# Altium project project1_ExtensionBoard.PrjPcb
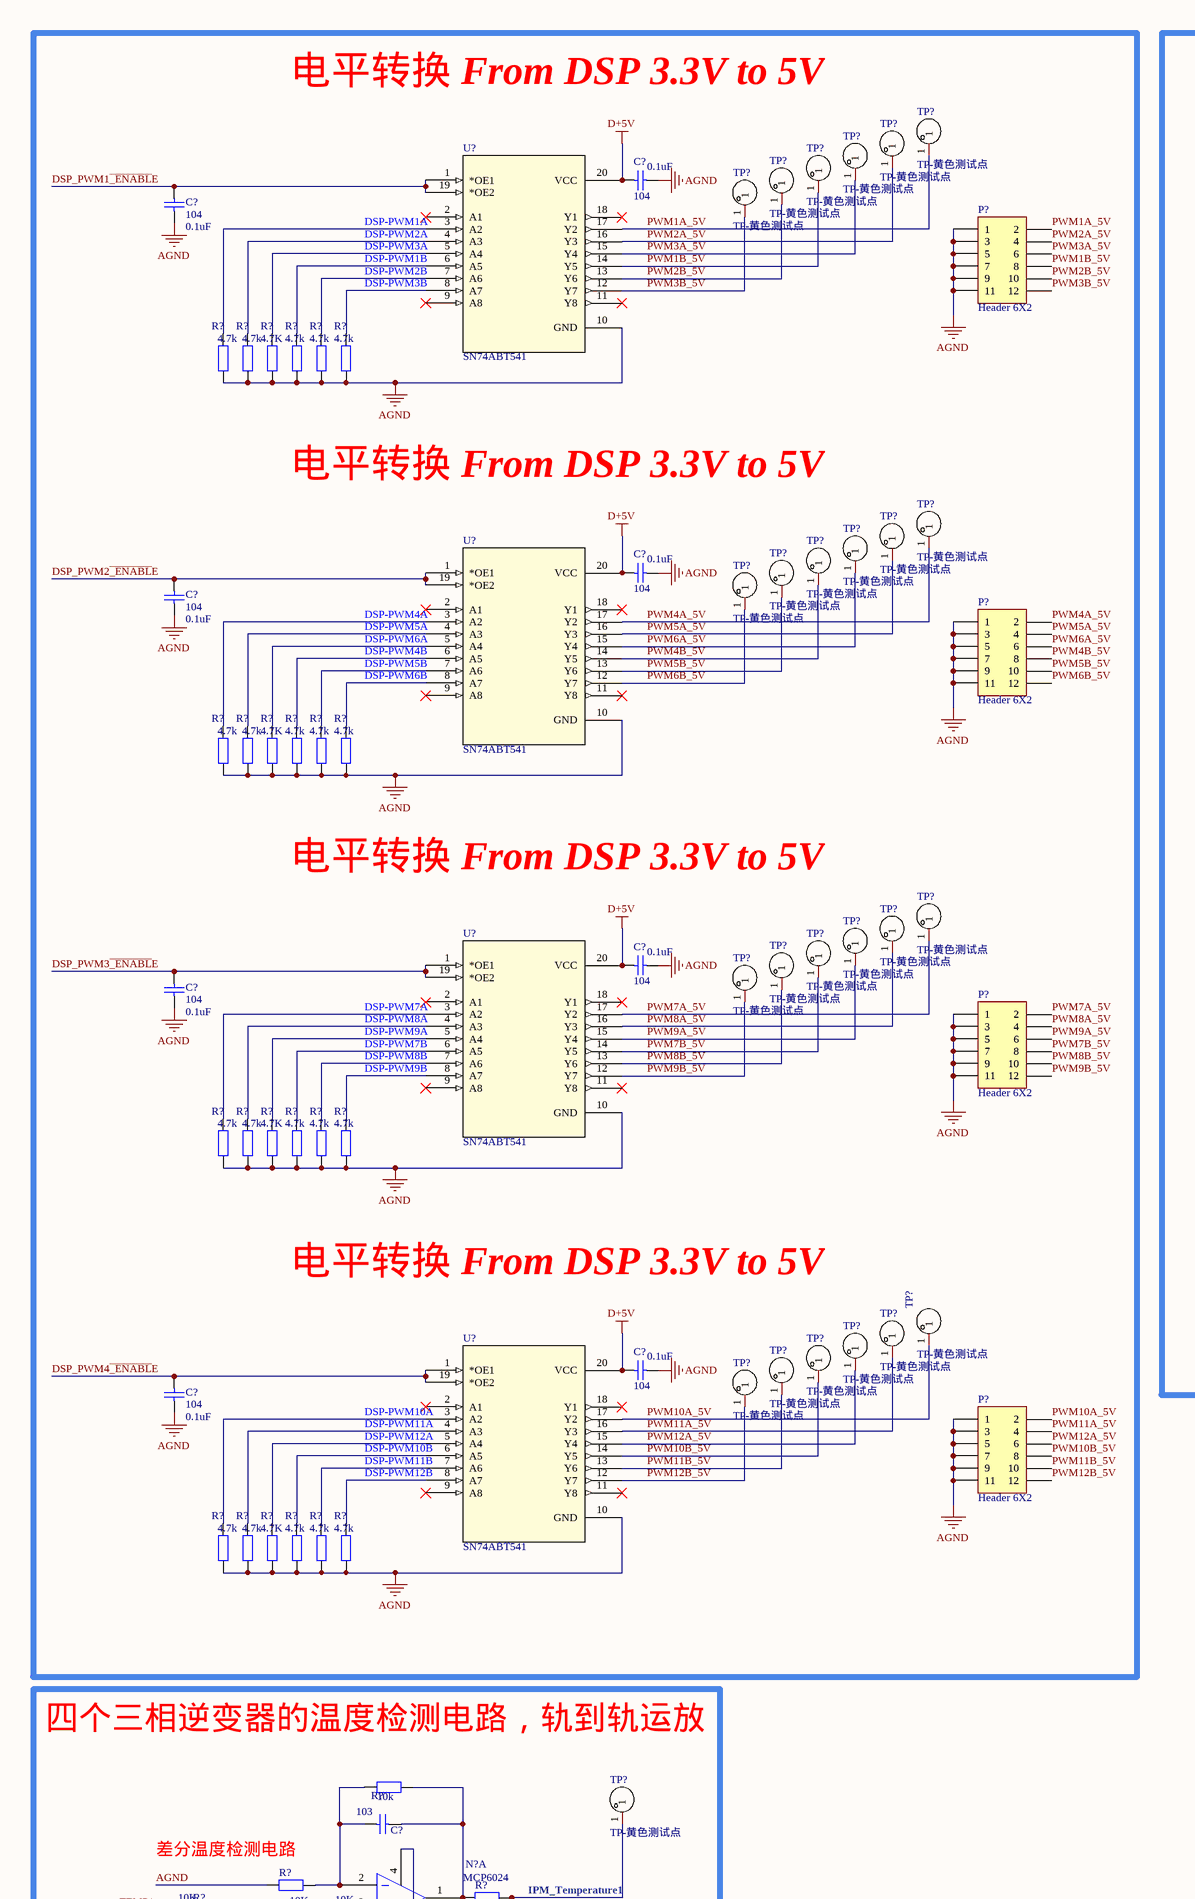
[diagram p0: sheet1.SchDoc, top left]
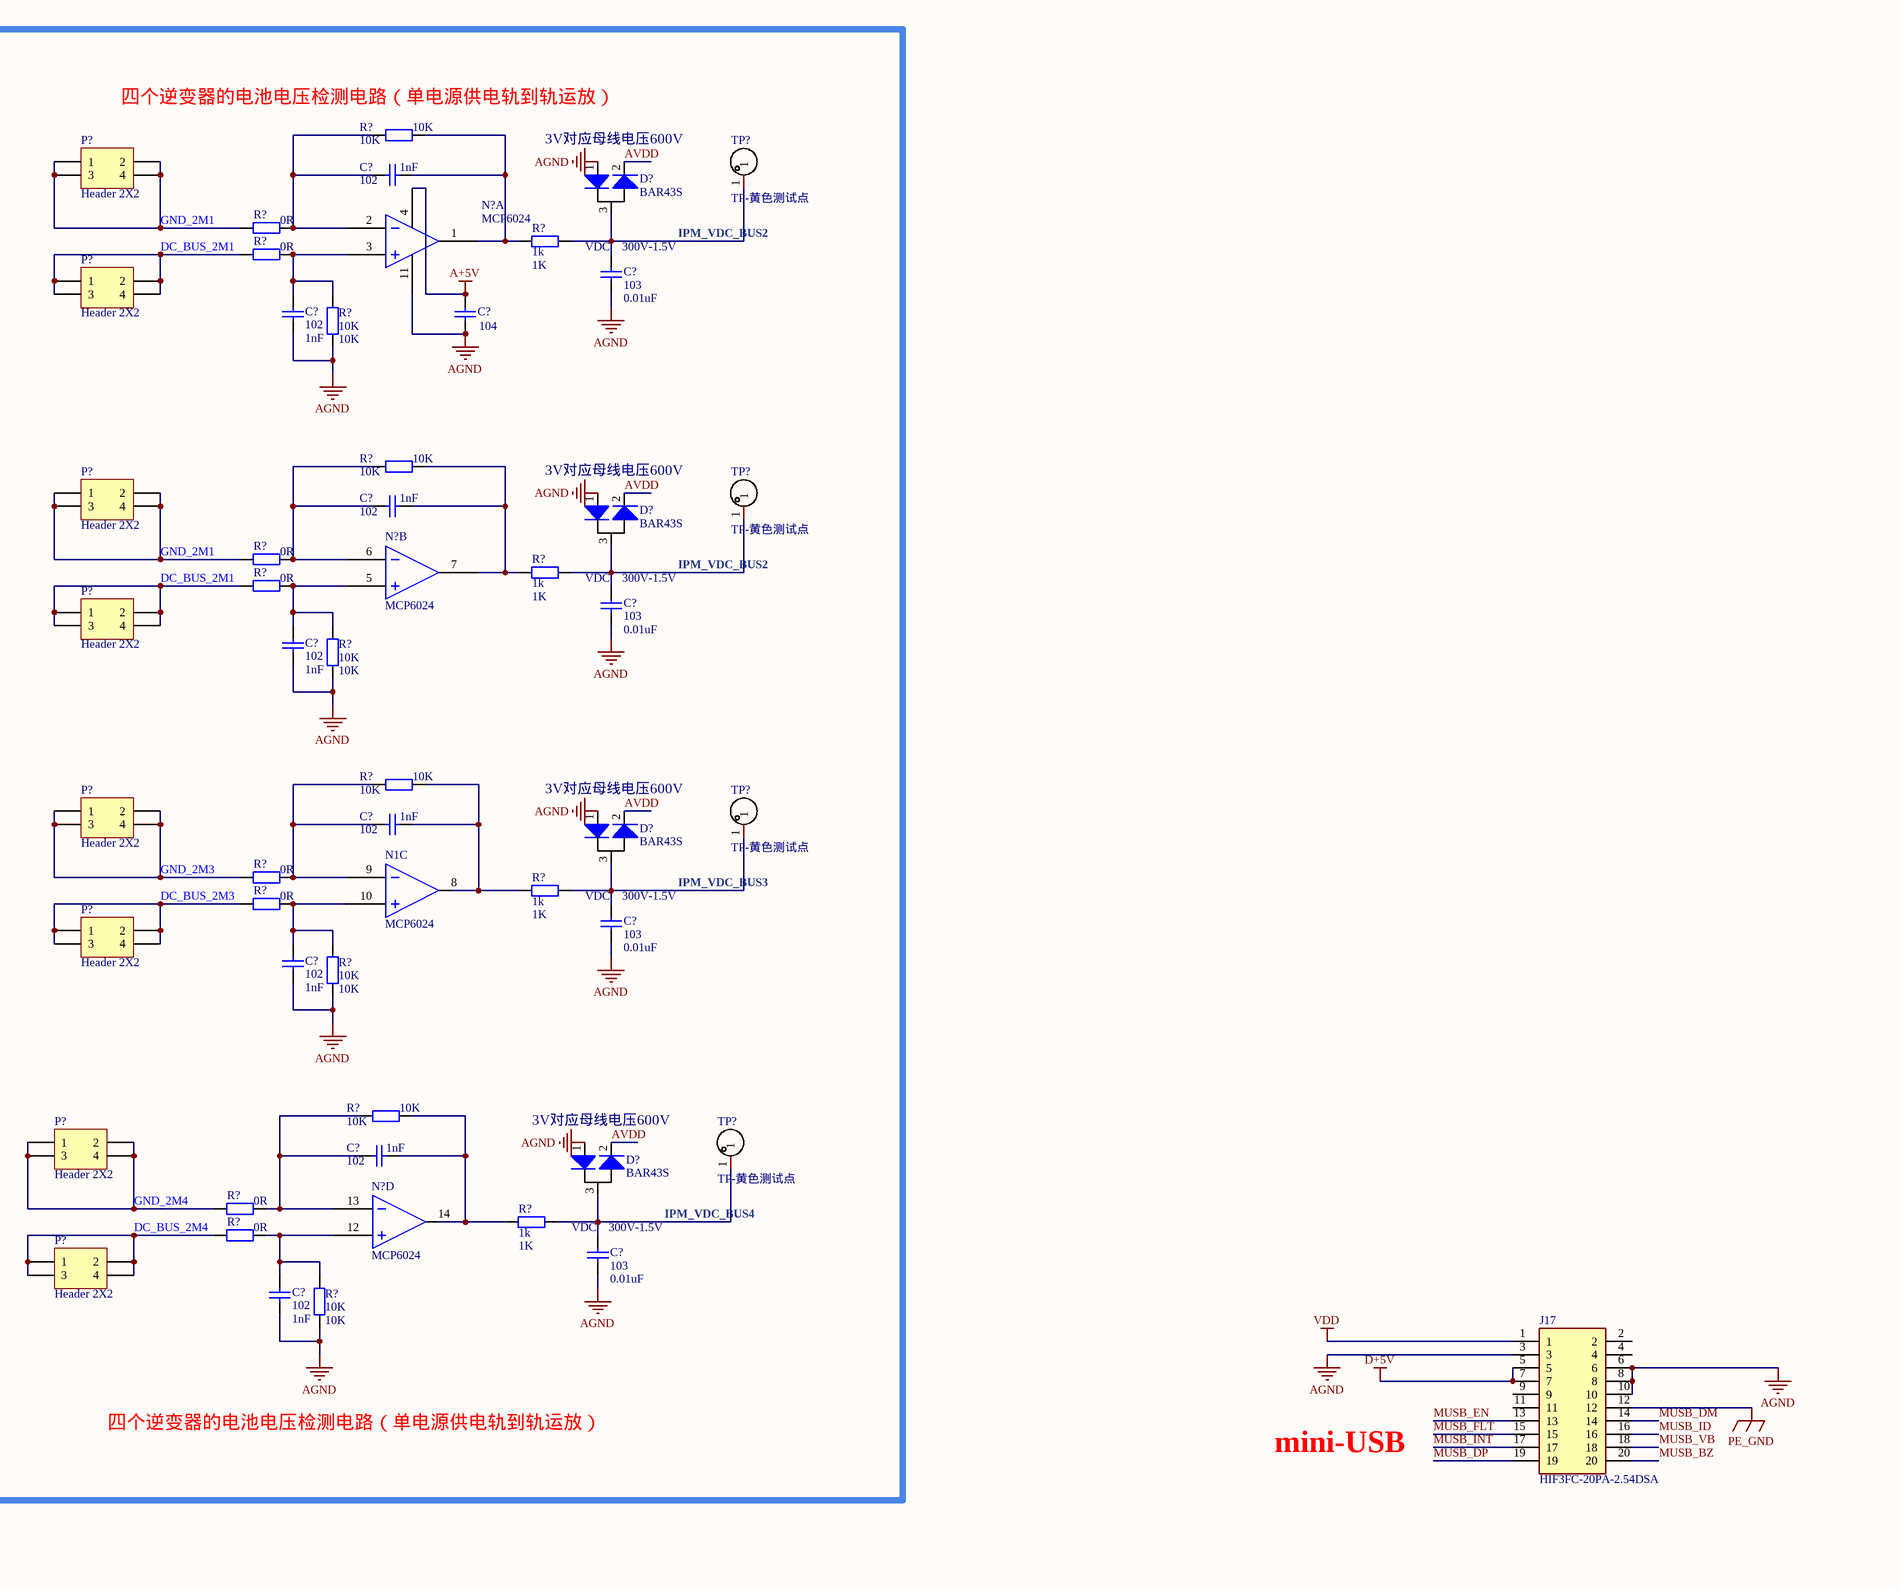
[diagram p1: sheet1.SchDoc, top middle]
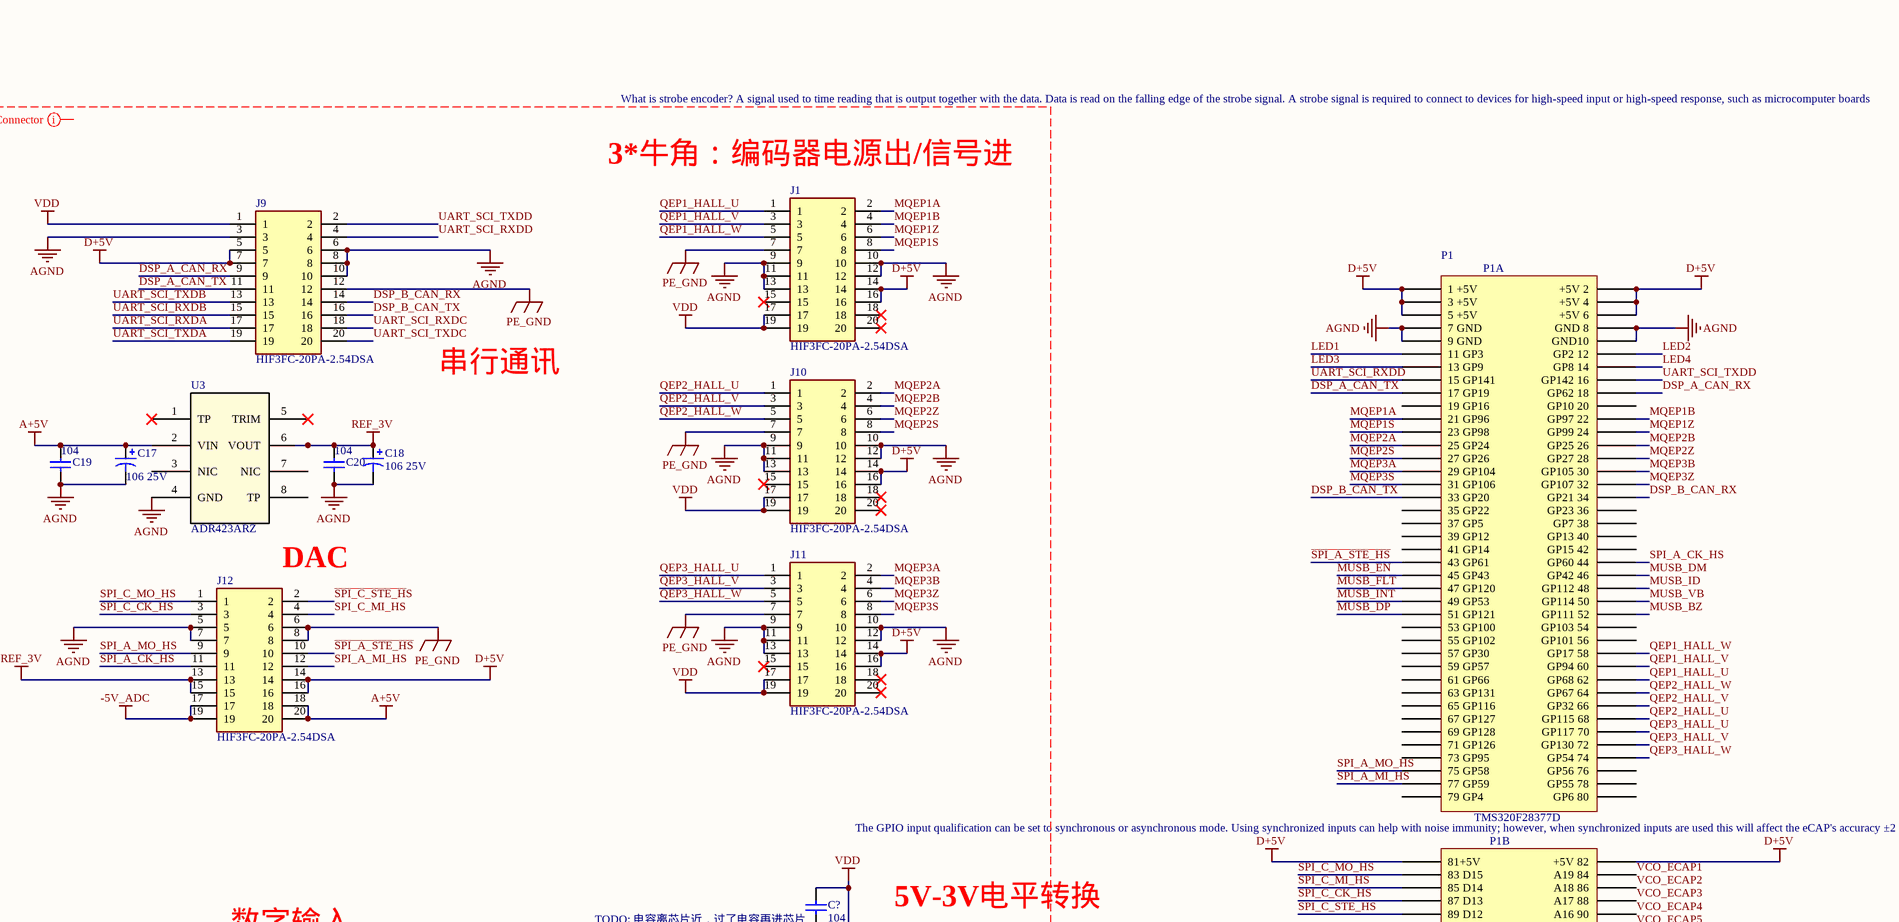
[diagram p2: sheet1.SchDoc, top right]
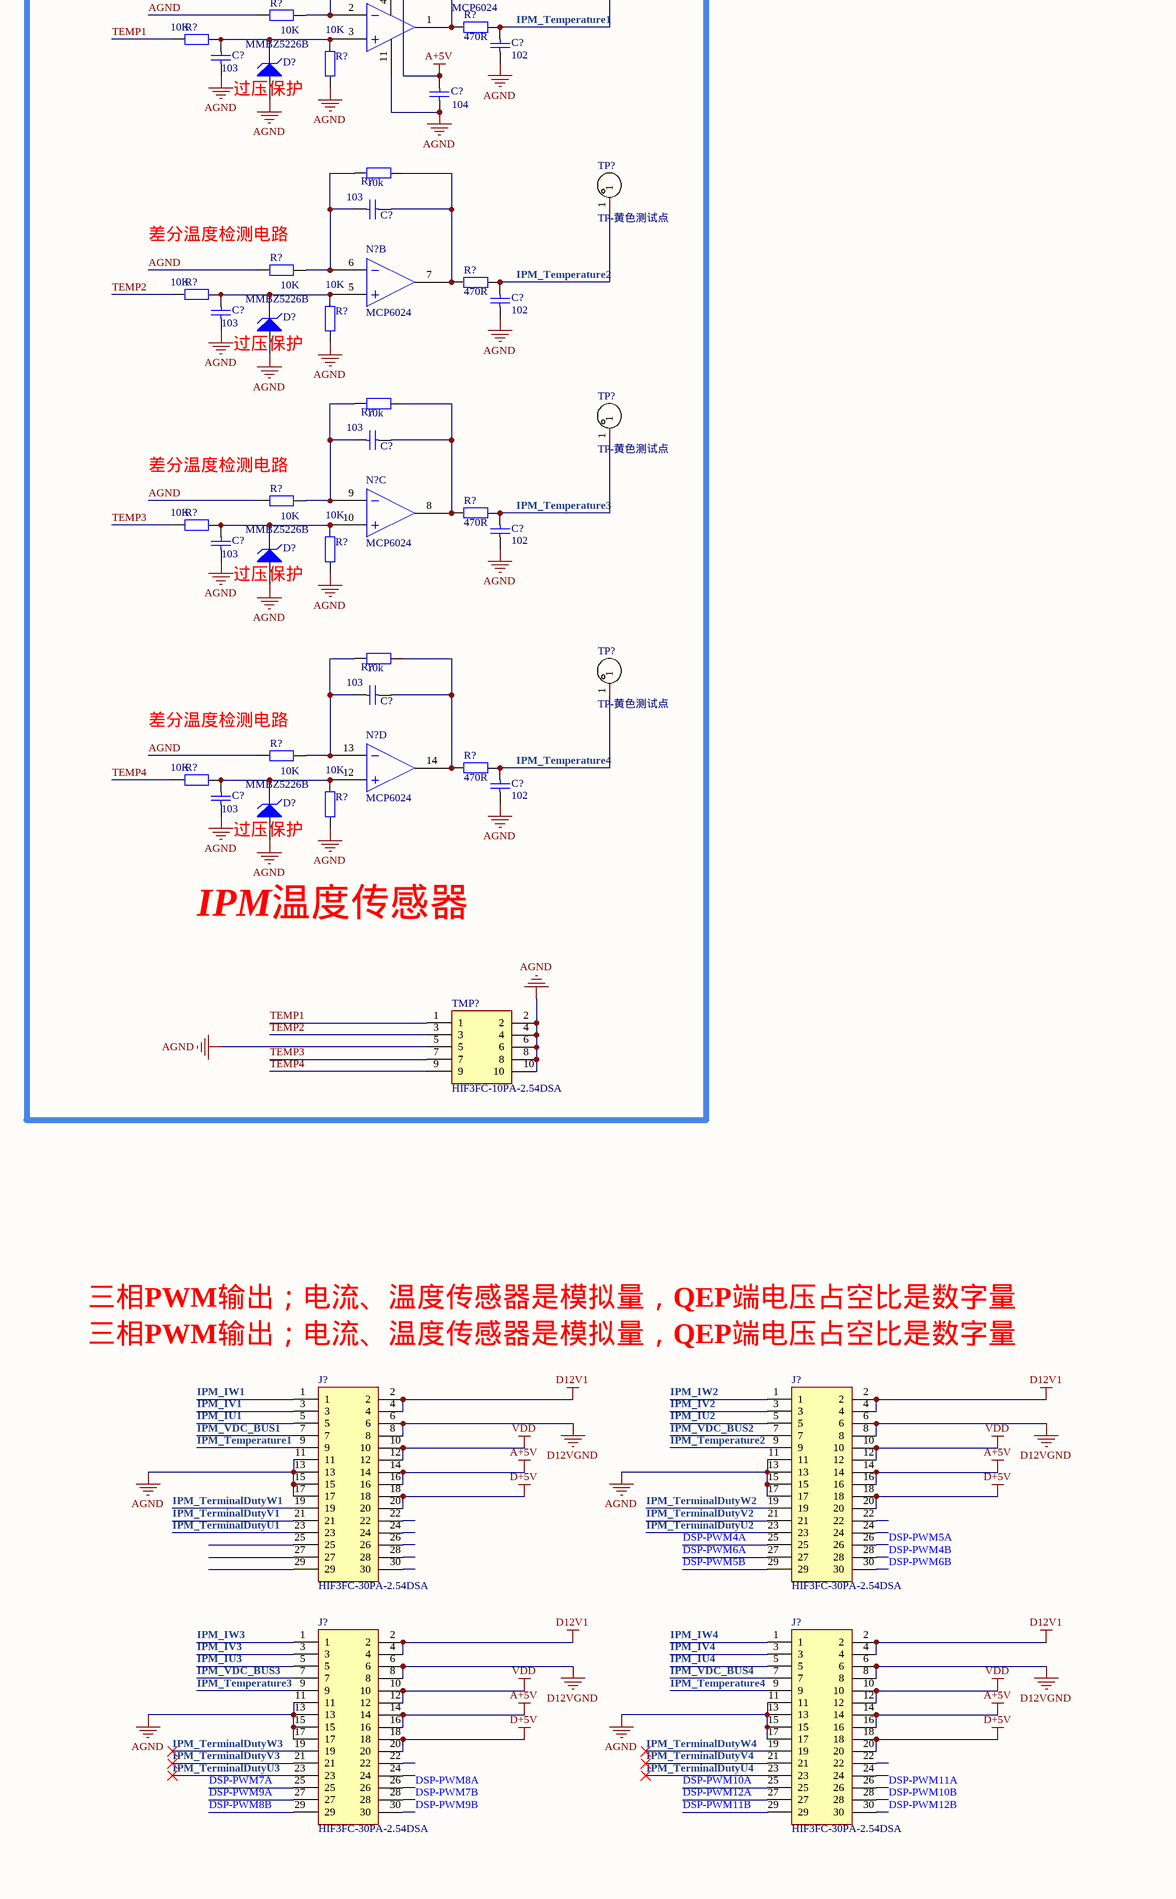
[diagram p3: sheet1.SchDoc, bottom left]
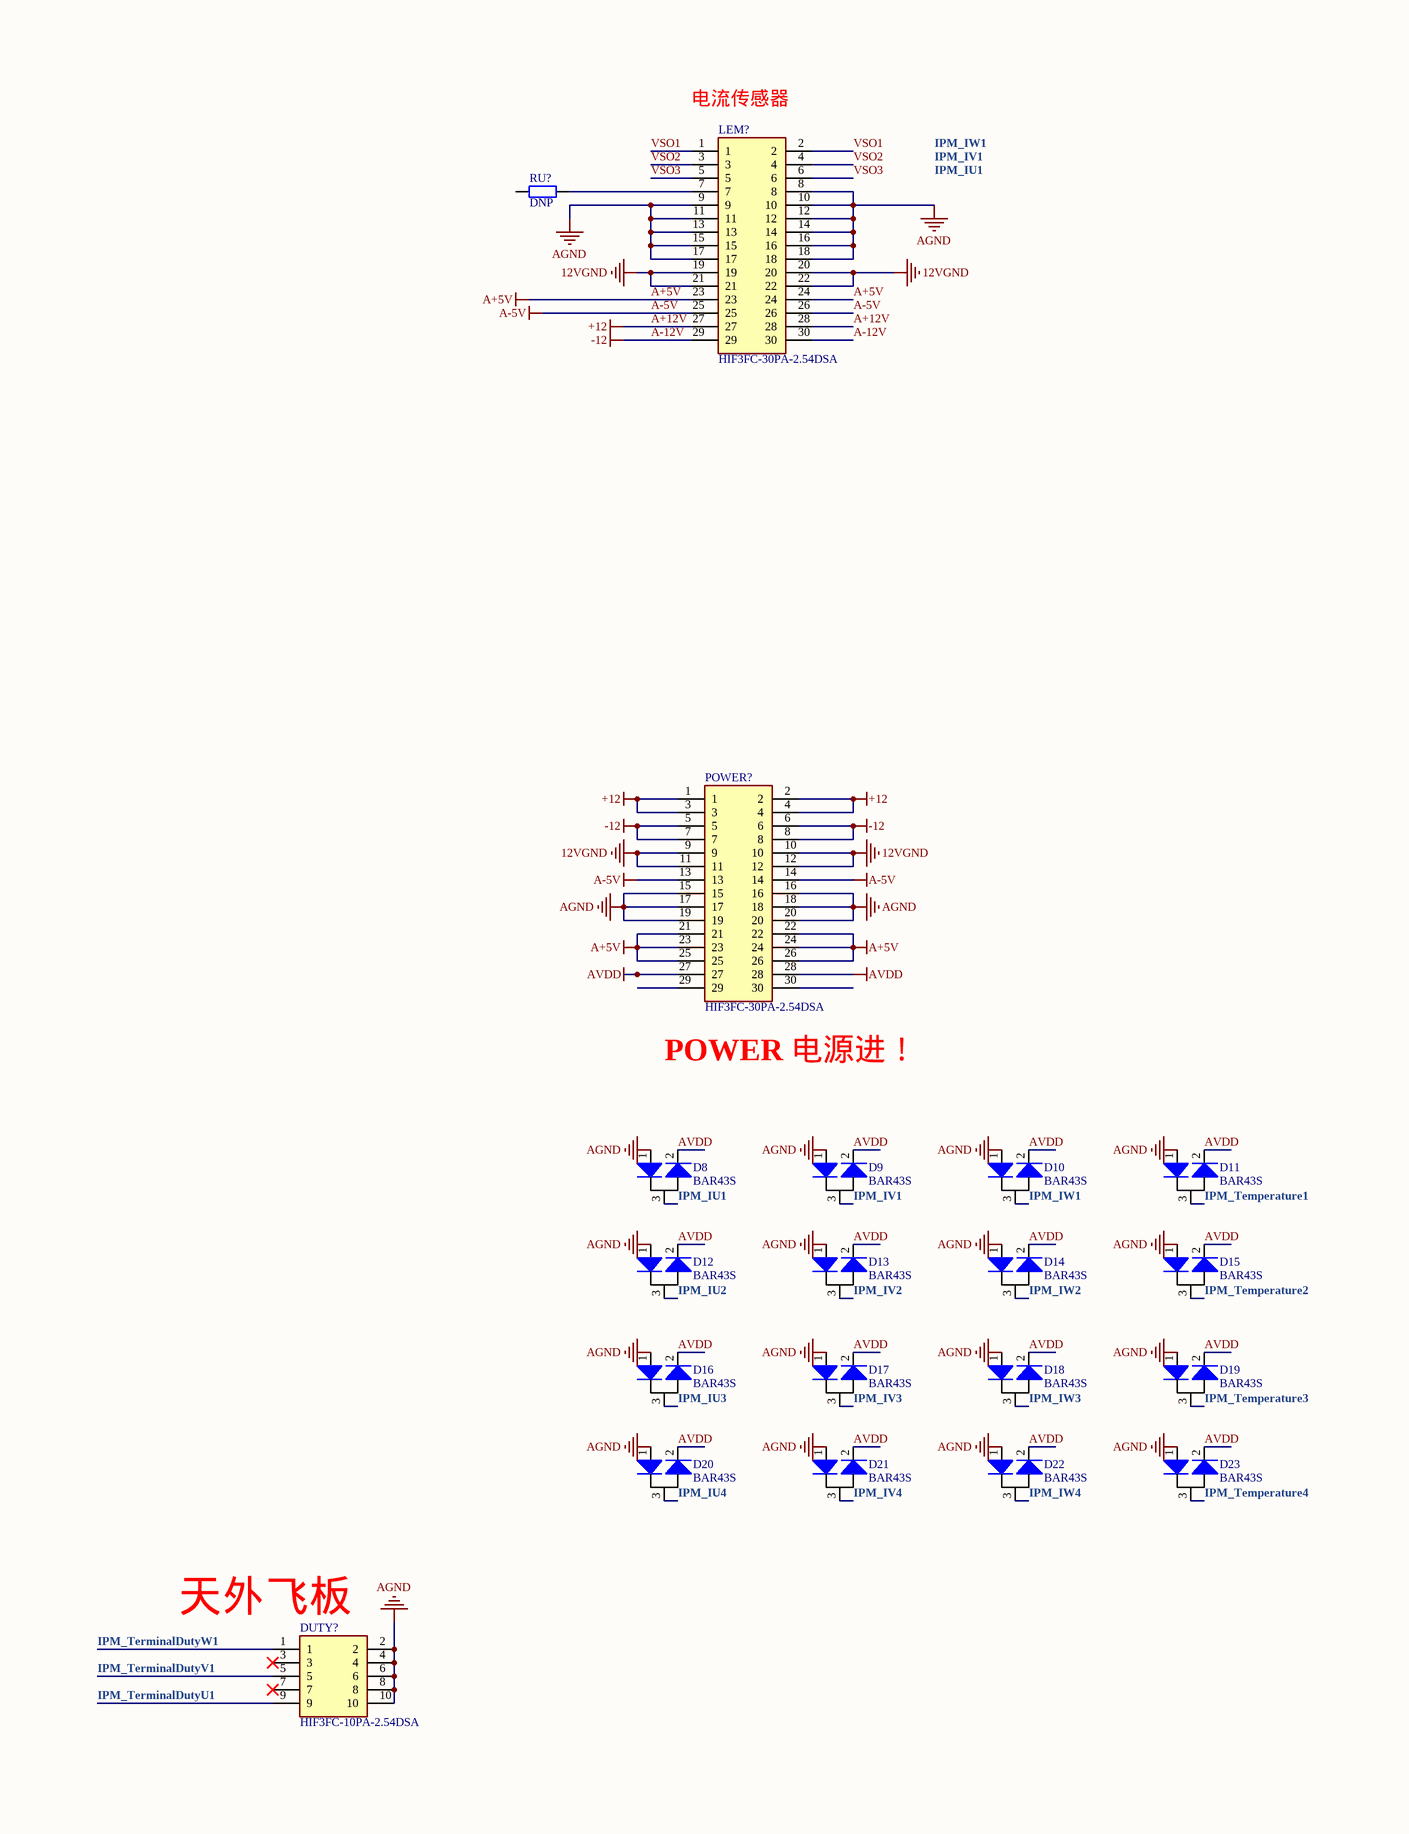
[diagram p4: sheet1.SchDoc, bottom middle]
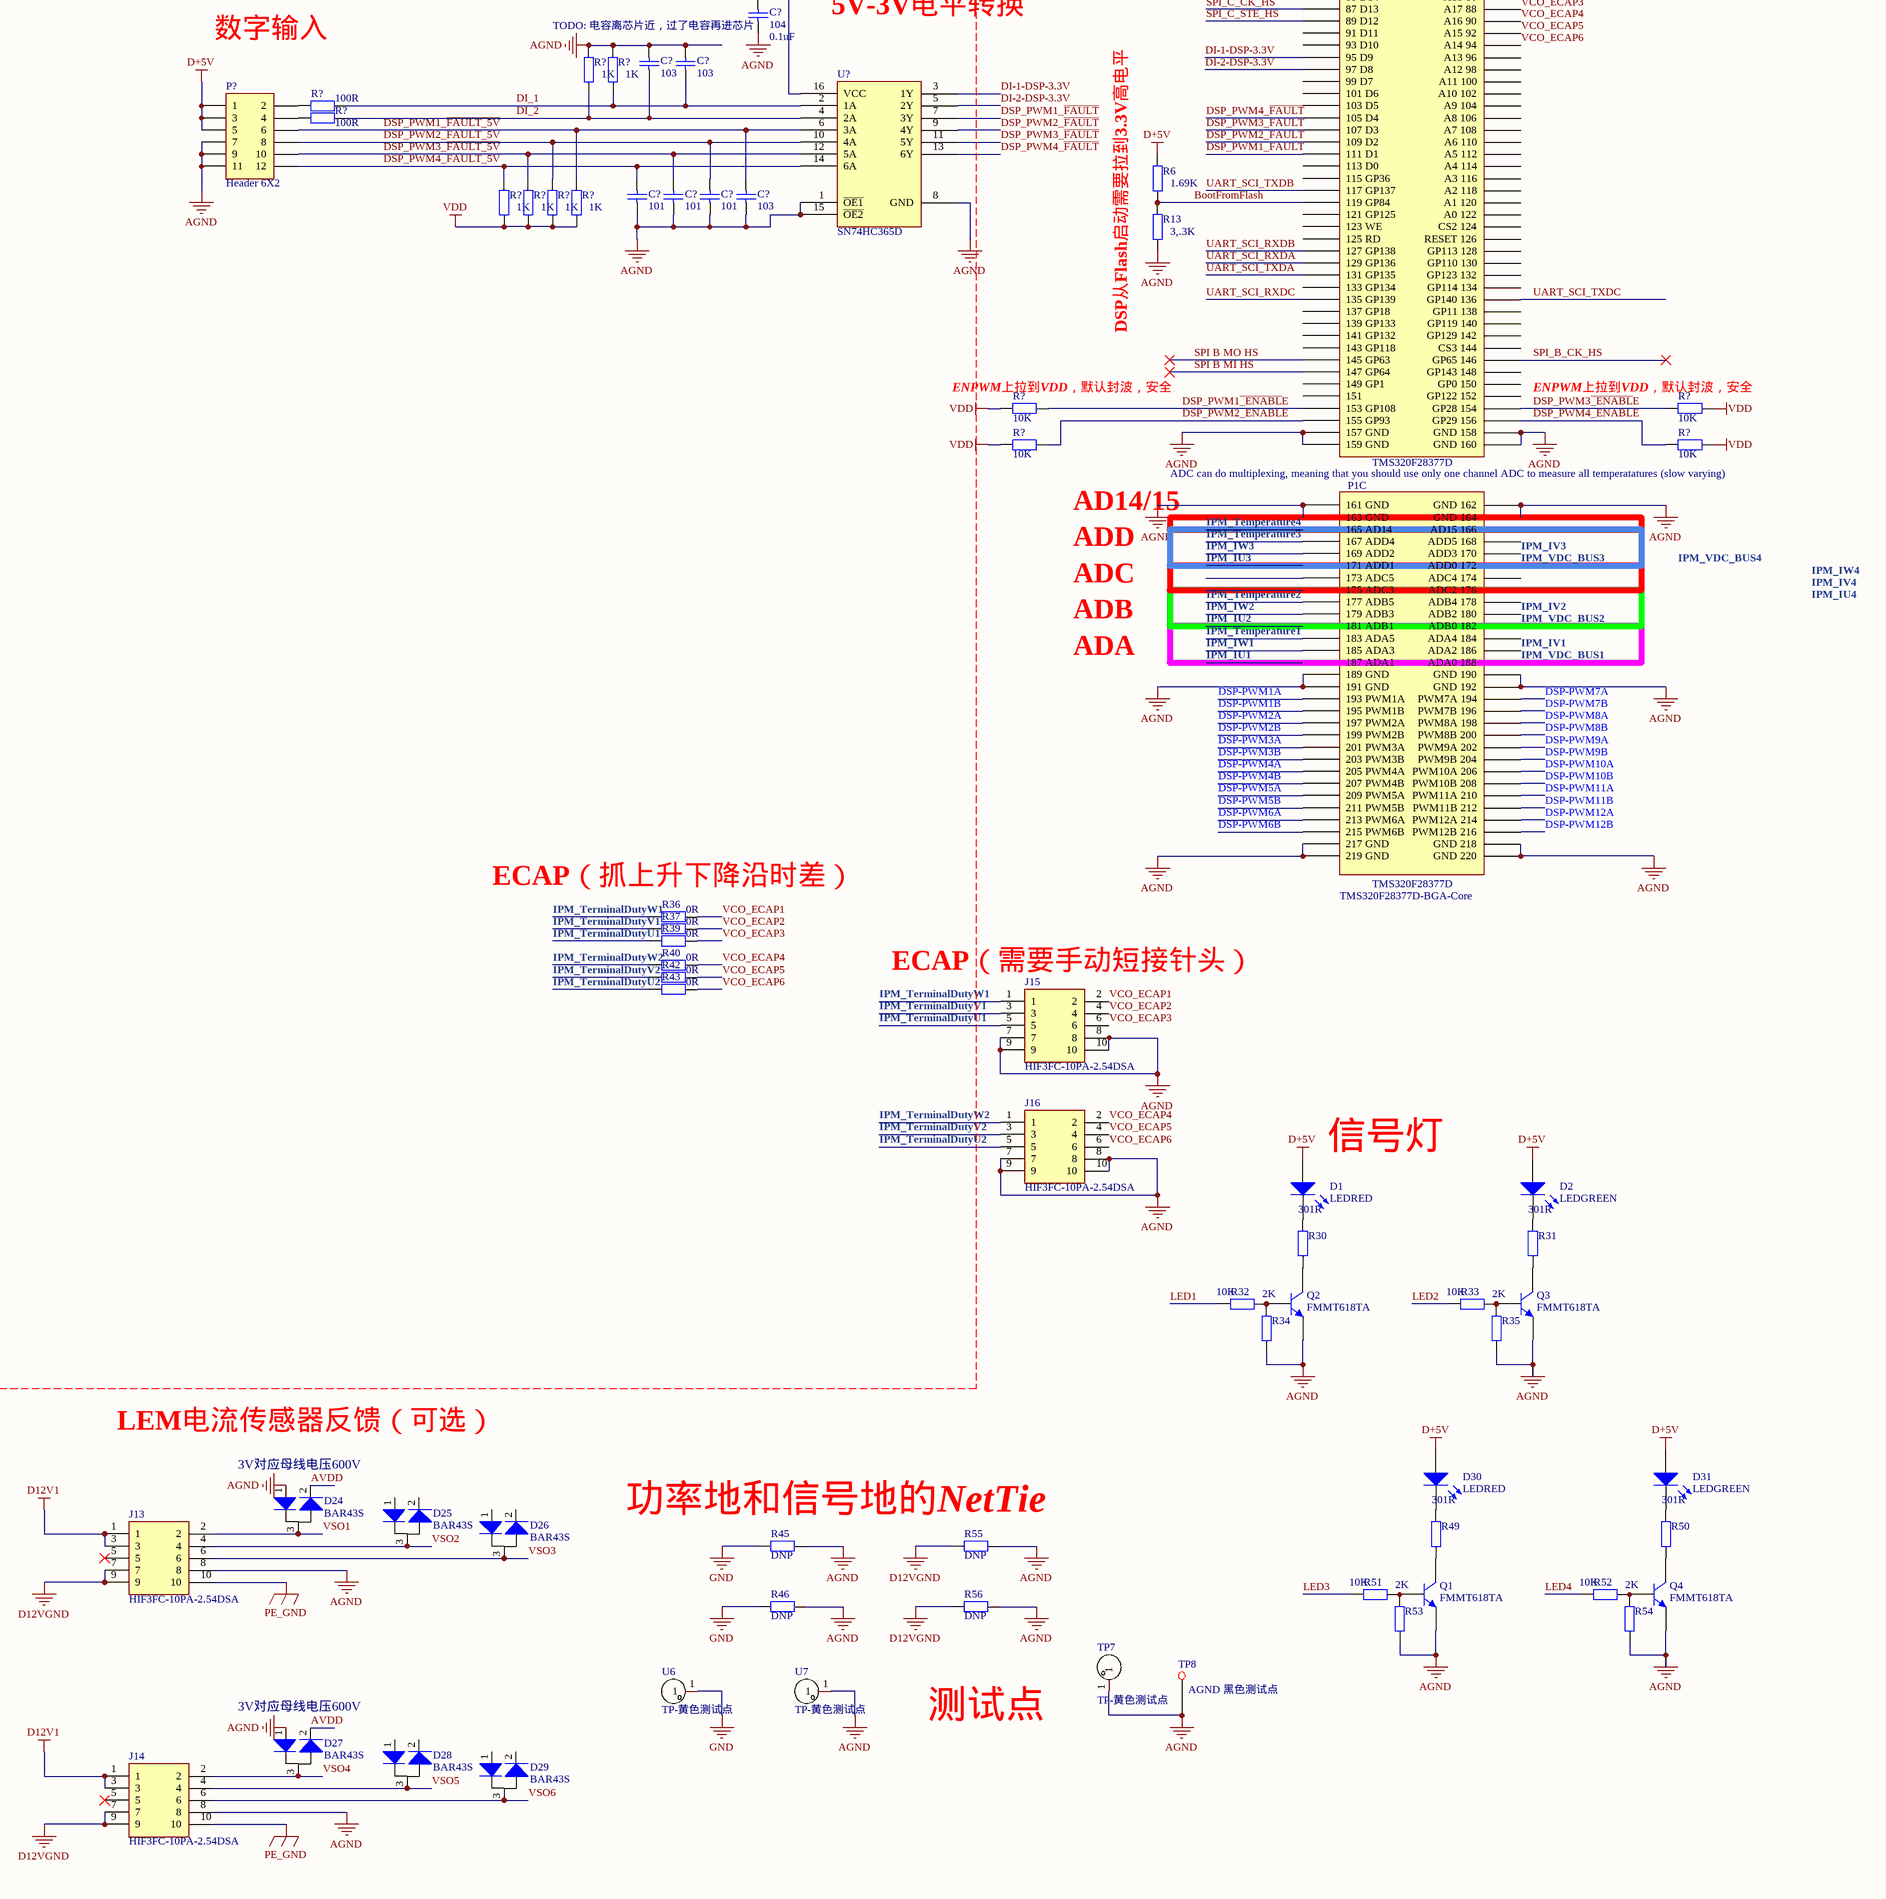
[diagram p5: sheet1.SchDoc, bottom right]
1 sheet, 266 parts. Net scope: global (net labels, ports and power ports of the same name join across sheets).
Board file: pcb1.PcbDoc

## Sheet sheet1.SchDoc
size A0

### Parts
(Parts that share a designator on the sheet are numbered #1, #2 ... from top to bottom, then left to right.)
C17  106 25V  [1206 (钽电容)]
C18  106 25V  [1206 (钽电容)]
C19  104  [0805]
C20  104  [0805]
C?#1  102  value 1nF  [0805]
C?#2  104  value 0.1uF  [0805]
C?#3  104  value 0.1uF  [0805]
C?#4  103  value 0.01uF  [0805]
C?#5  102  value 1nF  [0805]
C?#6  104  [0805]
C?#7  102  value 1nF  [0805]
C?#8  104  value 0.1uF  [0805]
C?#9  103  value 0.01uF  [0805]
C?#10  104  value 0.1uF  [0805]
C?#11  102  value 1nF  [0805]
C?#12  102  value 1nF  [0805]
C?#13  103  value 0.01uF  [0805]
C?#14  102  value 1nF  [0805]
C?#15  104  value 0.1uF  [0805]
C?#16  104  value 0.1uF  [0805]
C?#17  102  value 1nF  [0805]
C?#18  103  value 0.01uF  [0805]
C?#19  102  value 1nF  [0805]
C?#20  104  value 0.1uF  [0805]
C?#21  104  value 0.1uF  [0805]
C?#22  103  [0805]
C?#23  104  value 0.1uF  [0805]
C?#24  102  [0805]
C?#25  103  [0805]
C?#26  103  [0805]
C?#27  103  [0805]
C?#28  104  [0805]
C?#29  101  [0805]
C?#30  101  [0805]
C?#31  101  [0805]
C?#32  103  [0805]
C?#33  103  [0805]
C?#34  102  [0805]
C?#35  103  [0805]
C?#36  103  [0805]
C?#37  102  [0805]
C?#38  103  [0805]
C?#39  103  [0805]
C?#40  102  [0805]
C?#41  103  [0805]
D1  LEDRED  [L0805]
D2  LEDGREEN  [L0805]
D8  BAR43S  [SOT-23]
D9  BAR43S  [SOT-23]
D10  BAR43S  [SOT-23]
D11  BAR43S  [SOT-23]
D12  BAR43S  [SOT-23]
D13  BAR43S  [SOT-23]
D14  BAR43S  [SOT-23]
D15  BAR43S  [SOT-23]
D16  BAR43S  [SOT-23]
D17  BAR43S  [SOT-23]
D18  BAR43S  [SOT-23]
D19  BAR43S  [SOT-23]
D20  BAR43S  [SOT-23]
D21  BAR43S  [SOT-23]
D22  BAR43S  [SOT-23]
D23  BAR43S  [SOT-23]
D24  BAR43S  [SOT-23]
D25  BAR43S  [SOT-23]
D26  BAR43S  [SOT-23]
D27  BAR43S  [SOT-23]
D28  BAR43S  [SOT-23]
D29  BAR43S  [SOT-23]
D30  LEDRED  [L0805]
D31  LEDGREEN  [L0805]
D?#1  BAR43S  [SOT-23]
D?#2  BAR43S  [SOT-23]
D?#3  BAR43S  [SOT-23]
D?#4  BAR43S  [SOT-23]
D?#5  MMBZ5226B  [SOT-23]
D?#6  MMBZ5226B  [SOT-23]
D?#7  MMBZ5226B  [SOT-23]
D?#8  MMBZ5226B  [SOT-23]
DUTY?  HIF3FC-10PA-2.54DSA  [SHDR10W50P254_2X5_2020X850X920P]
J1  HIF3FC-20PA-2.54DSA  [SHDR20W56P254_2X10_3290X850X950P]
J9  HIF3FC-20PA-2.54DSA  [SHDR20W56P254_2X10_3290X850X950P]
J10  HIF3FC-20PA-2.54DSA  [SHDR20W56P254_2X10_3290X850X950P]
J11  HIF3FC-20PA-2.54DSA  [SHDR20W56P254_2X10_3290X850X950P]
J12  HIF3FC-20PA-2.54DSA  [SHDR20W56P254_2X10_3290X850X950P]
J13  HIF3FC-10PA-2.54DSA  [SHDR10W50P254_2X5_2020X850X920P]
J14  HIF3FC-10PA-2.54DSA  [SHDR10W50P254_2X5_2020X850X920P]
J15  HIF3FC-10PA-2.54DSA  [SHDR10W50P254_2X5_2020X850X920P]
J16  HIF3FC-10PA-2.54DSA  [SHDR10W50P254_2X5_2020X850X920P]
J17  HIF3FC-20PA-2.54DSA  [SHDR20W56P254_2X10_3290X850X950P]
J?#1  HIF3FC-30PA-2.54DSA  [SHDR30W50P254_2X15_4560X850X1200P]
J?#2  HIF3FC-30PA-2.54DSA  [SHDR30W50P254_2X15_4560X850X1200P]
J?#3  HIF3FC-30PA-2.54DSA  [SHDR30W50P254_2X15_4560X850X1200P]
J?#4  HIF3FC-30PA-2.54DSA  [SHDR30W50P254_2X15_4560X850X1200P]
LEM?  HIF3FC-30PA-2.54DSA  [SHDR30W50P254_2X15_4560X850X1200P]
N1  MCP6024  [SOIC14_M]  (part C of 4)
N?#1  MCP6024  [SOIC14_M]  (part A of 4)
N?#2  MCP6024  [SOIC14_M]  (part B of 4)
N?#3  MCP6024  [SOIC14_M]  (part D of 4)
N?#4  MCP6024  [SOIC14_M]  (part A of 4)
N?#5  MCP6024  [SOIC14_M]  (part B of 4)
N?#6  MCP6024  [SOIC14_M]  (part C of 4)
N?#7  MCP6024  [SOIC14_M]  (part D of 4)
P1  TMS320F28377D-BGA-Core  [DSP_240_0p6mm]
P?#1  Header 2X2  [HDR2X2]
P?#2  Header 6X2  [HDR2X6]
P?#3  Header 2X2  [HDR2X2]
P?#4  Header 2X2  [HDR2X2]
P?#5  Header 2X2  [HDR2X2]
P?#6  Header 6X2  [HDR2X6]
P?#7  Header 2X2  [HDR2X2]
P?#8  Header 2X2  [HDR2X2]
P?#9  Header 6X2  [HDR2X6]
P?#10  Header 2X2  [HDR2X2]
P?#11  Header 2X2  [HDR2X2]
P?#12  Header 6X2  [HDR2X6]
P?#13  Header 6X2  [HDR2X6]
POWER?  HIF3FC-30PA-2.54DSA  [HDR2.54-LI-2x15P]
Q1  FMMT618TA  [SOT-23]
Q2  FMMT618TA  [SOT-23]
Q3  FMMT618TA  [SOT-23]
Q4  FMMT618TA  [SOT-23]
R6  1.69K  [0805]
R13  3,.3K  [0805]
R30  301R  [0805]
R31  301R  [0805]
R32  10K  [0805]
R33  10K  [0805]
R34  2K  [0805]
R35  2K  [0805]
R36  0R  [0805]
R37  0R  [0805]
R39  0R  [0805]
R40  0R  [0805]
R42  0R  [0805]
R43  0R  [0805]
R45  DNP  [0805]
R46  DNP  [0805]
R49  301R  [0805]
R50  301R  [0805]
R51  10K  [0805]
R52  10K  [0805]
R53  2K  [0805]
R54  2K  [0805]
R55  DNP  [0805]
R56  DNP  [0805]
R?#1  10K  [0805]
R?#2  1k  [0805]
R?#3  0R  [0805]
R?#4  0R  [0805]
R?#5  10K  [0805]
R?#6  4.7k  [0805]
R?#7  4.7k  [0805]
R?#8  4.7K  [0805]
R?#9  4.7k  [0805]
R?#10  4.7k  [0805]
R?#11  4.7k  [0805]
R?#12  10K  [0805]
R?#13  1k  [0805]
R?#14  0R  [0805]
R?#15  0R  [0805]
R?#16  10K  [0805]
R?#17  10K  [0805]
R?#18  4.7k  [0805]
R?#19  4.7k  [0805]
R?#20  4.7K  [0805]
R?#21  4.7k  [0805]
R?#22  4.7k  [0805]
R?#23  4.7k  [0805]
R?#24  1k  [0805]
R?#25  0R  [0805]
R?#26  0R  [0805]
R?#27  10K  [0805]
R?#28  10K  [0805]
R?#29  1k  [0805]
R?#30  0R  [0805]
R?#31  4.7k  [0805]
R?#32  4.7k  [0805]
R?#33  4.7K  [0805]
R?#34  4.7k  [0805]
R?#35  4.7k  [0805]
R?#36  4.7k  [0805]
R?#37  0R  [0805]
R?#38  10K  [0805]
R?#39  4.7k  [0805]
R?#40  4.7k  [0805]
R?#41  4.7K  [0805]
R?#42  4.7k  [0805]
R?#43  4.7k  [0805]
R?#44  4.7k  [0805]
R?#45  10k  [0805]
R?#46  10K  [0805]
R?#47  10K  [0805]
R?#48  470R  [0805]
R?#49  10K  [0805]
R?#50  1K  [0805]
R?#51  1K  [0805]
R?#52  100R  [0805]
R?#53  100R  [0805]
R?#54  10k  [0805]
R?#55  1K  [0805]
R?#56  1K  [0805]
R?#57  1K  [0805]
R?#58  1K  [0805]
R?#59  10K  [0805]
R?#60  10K  [0805]
R?#61  470R  [0805]
R?#62  10K  [0805]
R?#63  10k  [0805]
R?#64  10K  [0805]
R?#65  10K  [0805]
R?#66  10K  [0805]
R?#67  10K  [0805]
R?#68  10K  [0805]
R?#69  10K  [0805]
R?#70  470R  [0805]
R?#71  10K  [0805]
R?#72  10k  [0805]
R?#73  10K  [0805]
R?#74  10K  [0805]
R?#75  470R  [0805]
R?#76  10K  [0805]
RU?  DNP  [0805]
TMP?  HIF3FC-10PA-2.54DSA  [SHDR10W50P254_2X5_2020X850X920P]
TP7  TP-黄色测试点  [TESTPOINT-TH_BD1.0]
TP8  AGND 黑色测试点  [TP]
TP?#1  TP-黄色测试点  [TESTPOINT-TH_BD1.0]
TP?#2  TP-黄色测试点  [TESTPOINT-TH_BD1.0]
TP?#3  TP-黄色测试点  [TESTPOINT-TH_BD1.0]
TP?#4  TP-黄色测试点  [TESTPOINT-TH_BD1.0]
TP?#5  TP-黄色测试点  [TESTPOINT-TH_BD1.0]
TP?#6  TP-黄色测试点  [TESTPOINT-TH_BD1.0]
TP?#7  TP-黄色测试点  [TESTPOINT-TH_BD1.0]
TP?#8  TP-黄色测试点  [TESTPOINT-TH_BD1.0]
TP?#9  TP-黄色测试点  [TESTPOINT-TH_BD1.0]
TP?#10  TP-黄色测试点  [TESTPOINT-TH_BD1.0]
TP?#11  TP-黄色测试点  [TESTPOINT-TH_BD1.0]
TP?#12  TP-黄色测试点  [TESTPOINT-TH_BD1.0]
TP?#13  TP-黄色测试点  [TESTPOINT-TH_BD1.0]
TP?#14  TP-黄色测试点  [TESTPOINT-TH_BD1.0]
TP?#15  TP-黄色测试点  [TESTPOINT-TH_BD1.0]
TP?#16  TP-黄色测试点  [TESTPOINT-TH_BD1.0]
TP?#17  TP-黄色测试点  [TESTPOINT-TH_BD1.0]
TP?#18  TP-黄色测试点  [TESTPOINT-TH_BD1.0]
TP?#19  TP-黄色测试点  [TESTPOINT-TH_BD1.0]
TP?#20  TP-黄色测试点  [TESTPOINT-TH_BD1.0]
TP?#21  TP-黄色测试点  [TESTPOINT-TH_BD1.0]
TP?#22  TP-黄色测试点  [TESTPOINT-TH_BD1.0]
TP?#23  TP-黄色测试点  [TESTPOINT-TH_BD1.0]
TP?#24  TP-黄色测试点  [TESTPOINT-TH_BD1.0]
TP?#25  TP-黄色测试点  [TESTPOINT-TH_BD1.0]
TP?#26  TP-黄色测试点  [TESTPOINT-TH_BD1.0]
TP?#27  TP-黄色测试点  [TESTPOINT-TH_BD1.0]
TP?#28  TP-黄色测试点  [TESTPOINT-TH_BD1.0]
TP?#29  TP-黄色测试点  [TESTPOINT-TH_BD1.0]
TP?#30  TP-黄色测试点  [TESTPOINT-TH_BD1.0]
TP?#31  TP-黄色测试点  [TESTPOINT-TH_BD1.0]
TP?#32  TP-黄色测试点  [TESTPOINT-TH_BD1.0]
U3  ADR423ARZ  [SOIC-8]
U6  TP-黄色测试点  [TESTPOINT-TH_BD1.0]
U7  TP-黄色测试点  [TESTPOINT-TH_BD1.0]
U?#1  SN74ABT541  [TSSOP-20]
U?#2  SN74ABT541  [TSSOP-20]
U?#3  SN74ABT541  [TSSOP-20]
U?#4  SN74ABT541  [TSSOP-20]
U?#5  SN74HC365D  [D016_N]

### Blocks framed on the sheet
IPM温度传感器: C?#22 C?#24 C?#27 C?#28 C?#33-C?#41 D?#5-D?#8 N?#4-N?#7 R?#45-R?#49 R?#54 R?#59-R?#63 R?#68-R?#76 TMP? TP?#29-TP?#32

### Nets
12VGND: LEM?.19 LEM?.20 LEM?.21 LEM?.22 POWER?.9 POWER?.10 POWER?.11 POWER?.12
-5V_ADC: J12.17 J12.19
A+5V: C17.1 C19.2 C?#6.2 C?#28.2 J12.18 J12.20 J?#1.14 J?#1.16 J?#2.14 J?#2.16 J?#3.14 J?#3.16 J?#4.14 J?#4.16 LEM?.23 LEM?.24 N?#1.4 N?#4.4 POWER?.21 POWER?.22 POWER?.23 POWER?.24 POWER?.25 POWER?.26 U3.2(VIN)
A+12V: LEM?.27 LEM?.28 POWER?.1 POWER?.2 POWER?.3 POWER?.4  [also labelled +12]
A-5V: LEM?.25 LEM?.26 POWER?.13 POWER?.14
A-12V: LEM?.29 LEM?.30 POWER?.5 POWER?.6 POWER?.7 POWER?.8  [also labelled -12]
AGND: C17.2 C18.2 C19.1 C20.1 C?#2.2 C?#3.1 C?#4.1 C?#5.1 C?#6.1 C?#8.2 C?#9.1 C?#10.1 C?#11.1 C?#13.1 C?#14.1 C?#15.2 C?#16.1 C?#18.1 C?#19.1 C?#20.2 C?#21.1 C?#23.2 C?#24.1 C?#25.1 C?#26.1 C?#27.1 C?#28.1 C?#29.2 C?#30.2 C?#31.2 C?#32.2 C?#34.1 C?#35.1 C?#37.1 C?#38.1 C?#40.1 C?#41.1 D8.1 D9.1 D10.1 D11.1 D12.1 D13.1 D14.1 D15.1 D16.1 D17.1 D18.1 D19.1 D20.1 D21.1 D22.1 D23.1 D24.1 D27.1 D?#1.1 D?#2.1 D?#3.1 D?#4.1 D?#5.1 D?#6.1 D?#7.1 D?#8.1 DUTY?.2 DUTY?.4 DUTY?.6 DUTY?.8 DUTY?.10 J1.9 J1.10 J1.11 J1.12 J1.13 J9.3 J9.6 J9.8 J9.10 J10.9 J10.10 J10.11 J10.12 J10.13 J11.9 J11.10 J11.11 J11.12 J11.13 J12.5 J12.7 J13.8 J14.8 J15.7 J15.8 J15.9 J15.10 J16.7 J16.8 J16.9 J16.10 J17.3 J17.6 J17.8 J17.10 J?#1.11 J?#1.13 J?#1.15 J?#1.17 J?#2.11 J?#2.13 J?#2.15 J?#2.17 J?#3.11 J?#3.13 J?#3.15 J?#3.17 J?#4.11 J?#4.13 J?#4.15 J?#4.17 LEM?.8 LEM?.9 LEM?.10 LEM?.11 LEM?.12 LEM?.13 LEM?.14 LEM?.15 LEM?.16 LEM?.17 LEM?.18 N?#1.11 N?#4.11 P1.7(7_GND) P1.8(GND_8) P1.9(9_GND) P1.10(GND10) P1.157(157_GND) P1.158(GND_158) P1.159(159_GND) P1.160(GND_160) P1.161(161_GND) P1.162(GND_162) P1.163(163_GND) P1.164(GND_164) P1.189(189_GND) P1.190(GND_190) P1.191(191_GND) P1.192(GND_192) P1.217(217_GND) P1.218(GND_218) P1.219(219_GND) P1.220(GND_220) P?#2.1 P?#2.3 P?#2.5 P?#2.7 P?#2.9 P?#2.11 P?#6.1 P?#6.3 P?#6.5 P?#6.7 P?#6.9 P?#6.11 P?#9.1 P?#9.3 P?#9.5 P?#9.7 P?#9.9 P?#9.11 P?#12.1 P?#12.3 P?#12.5 P?#12.7 P?#12.9 P?#12.11 P?#13.7 P?#13.9 P?#13.11 POWER?.15 POWER?.16 POWER?.17 POWER?.18 POWER?.19 POWER?.20 Q1.2(E) Q2.2(E) Q3.2(E) Q4.2(E) R13.1 R34.2 R35.2 R45.2 R46.2 R53.2 R54.2 R55.2 R56.2 R?#5.1 R?#6.1 R?#7.1 R?#8.1 R?#9.1 R?#10.1 R?#11.1 R?#16.1 R?#18.1 R?#19.1 R?#20.1 R?#21.1 R?#22.1 R?#23.1 R?#27.1 R?#31.1 R?#32.1 R?#33.1 R?#34.1 R?#35.1 R?#36.1 R?#38.1 R?#39.1 R?#40.1 R?#41.1 R?#42.1 R?#43.1 R?#44.1 R?#47.2 R?#49.2 R?#50.2 R?#51.2 R?#60.2 R?#62.2 R?#69.2 R?#71.2 R?#74.2 R?#76.2 TMP?.2 TMP?.4 TMP?.5 TMP?.6 TMP?.8 TMP?.10 TP7.1 TP8.1 U3.4(GND) U7.1 U?#1.10(GND) U?#2.10(GND) U?#3.10(GND) U?#4.10(GND) U?#5.1(~{OE1}) U?#5.8(GND) U?#5.15(~{OE2})
AVDD: D8.2 D9.2 D10.2 D11.2 D12.2 D13.2 D14.2 D15.2 D16.2 D17.2 D18.2 D19.2 D20.2 D21.2 D22.2 D23.2 D24.2 D27.2 D?#1.2 D?#2.2 D?#3.2 D?#4.2 POWER?.27 POWER?.28
D12V1: J13.1 J13.3 J14.1 J14.3 J?#1.2 J?#1.4 J?#2.2 J?#2.4 J?#3.2 J?#3.4 J?#4.2 J?#4.4
D12VGND: J13.7 J13.9 J14.7 J14.9 J?#1.6 J?#1.8 J?#2.6 J?#2.8 J?#3.6 J?#3.8 J?#4.6 J?#4.8 R55.1 R56.1
D+5V: C?#2.1 C?#8.1 C?#15.1 C?#20.1 D1.1(A) D2.1(A) D30.1(A) D31.1(A) J1.14 J1.16 J9.5 J9.7 J10.14 J10.16 J11.14 J11.16 J12.14 J12.16 J17.5 J17.7 J?#1.18 J?#1.20 J?#2.18 J?#2.20 J?#3.18 J?#3.20 J?#4.18 J?#4.20 P1.1(1_+5V) P1.2(+5V_2) P1.3(3_+5V) P1.4(+5V_4) P1.5(5_+5V) P1.6(+5V_6) P1.81(81+5V) P1.82(+5V_82) P?#13.1 P?#13.3 P?#13.5 R6.2 U?#1.20(VCC) U?#2.20(VCC) U?#3.20(VCC) U?#4.20(VCC)
GND: R45.1 R46.1 U6.1
PE_GND: J1.7 J9.12 J10.7 J11.7 J12.6 J12.8 J13.10 J14.10 J17.12
REF_3V: C18.1 C20.2 J12.13 J12.15 U3.6(VOUT)
VDD: C?#23.1 J1.17 J1.19 J9.1 J10.17 J10.19 J11.17 J11.19 J17.1 J?#1.10 J?#1.12 J?#2.10 J?#2.12 J?#3.10 J?#3.12 J?#4.10 J?#4.12 R?#55.1 R?#56.1 R?#57.1 R?#58.1 R?#64.2 R?#65.1 R?#66.2 R?#67.1 U?#5.16(VCC)
~{SPI_C_STE_H}S: J12.2 P1.89(89_D12)
BootFromFlash: P1.119(119_GP84) R6.1 R13.2
DC_BUS_2M1: P?#3.1 P?#3.2 P?#3.3 P?#3.4 P?#5.1 P?#5.2 P?#5.3 P?#5.4 R?#4.2 R?#15.2
DC_BUS_2M3: P?#8.1 P?#8.2 P?#8.3 P?#8.4 R?#26.2
DC_BUS_2M4: P?#11.1 P?#11.2 P?#11.3 P?#11.4 R?#37.2
DI-1-DSP-3.3V: P1.95(95_D9) U?#5.3(1Y)
DI-2-DSP-3.3V: P1.97(97_D8) U?#5.5(2Y)
DI_1: C?#26.2 R?#51.1 R?#52.1 U?#5.2(1A)
DI_2: C?#25.2 R?#50.1 R?#53.1 U?#5.4(2A)
DSP-PWM1A: P1.193(193_PWM1A) R?#6.2 U?#1.3(A2)
DSP-PWM1B: P1.195(195_PWM1B) R?#9.2 U?#1.6(A5)
DSP-PWM2A: P1.197(197_PWM2A) R?#7.2 U?#1.4(A3)
DSP-PWM2B: P1.199(199_PWM2B) R?#10.2 U?#1.7(A6)
DSP-PWM3A: P1.201(201_PWM3A) R?#8.2 U?#1.5(A4)
DSP-PWM3B: P1.203(203_PWM3B) R?#11.2 U?#1.8(A7)
DSP-PWM4A: J?#2.25 P1.205(205_PWM4A) R?#18.2 U?#2.3(A2)
DSP-PWM4B: J?#2.28 P1.207(207_PWM4B) R?#21.2 U?#2.6(A5)
DSP-PWM5A: J?#2.26 P1.209(209_PWM5A) R?#19.2 U?#2.4(A3)
DSP-PWM5B: J?#2.29 P1.211(211_PWM5B) R?#22.2 U?#2.7(A6)
DSP-PWM6A: J?#2.27 P1.213(213_PWM6A) R?#20.2 U?#2.5(A4)
DSP-PWM6B: J?#2.30 P1.215(215_PWM6B) R?#23.2 U?#2.8(A7)
DSP-PWM7A: J?#3.25 P1.194(PWM7A_194) R?#31.2 U?#3.3(A2)
DSP-PWM7B: J?#3.28 P1.196(PWM7B_196) R?#34.2 U?#3.6(A5)
DSP-PWM8A: J?#3.26 P1.198(PWM8A_198) R?#32.2 U?#3.4(A3)
DSP-PWM8B: J?#3.29 P1.200(PWM8B_200) R?#35.2 U?#3.7(A6)
DSP-PWM9A: J?#3.27 P1.202(PWM9A_202) R?#33.2 U?#3.5(A4)
DSP-PWM9B: J?#3.30 P1.204(PWM9B_204) R?#36.2 U?#3.8(A7)
DSP-PWM10A: J?#4.25 P1.206(PWM10A_206) R?#39.2 U?#4.3(A2)
DSP-PWM10B: J?#4.28 P1.208(PWM10B_208) R?#42.2 U?#4.6(A5)
DSP-PWM11A: J?#4.26 P1.210(PWM11A_210) R?#40.2 U?#4.4(A3)
DSP-PWM11B: J?#4.29 P1.212(PWM11B_212) R?#43.2 U?#4.7(A6)
DSP-PWM12A: J?#4.27 P1.214(PWM12A_214) R?#41.2 U?#4.5(A4)
DSP-PWM12B: J?#4.30 P1.216(PWM12B_216) R?#44.2 U?#4.8(A7)
DSP_A_CAN_RX: J9.9 P1.18(GP62_18)
DSP_A_CAN_TX: J9.11 P1.17(17_GP19)
DSP_B_CAN_RX: J9.14 P1.34(GP21_34)
DSP_B_CAN_TX: J9.16 P1.33(33_GP20)
DSP_PWM1~{_ENABL}E: C?#3.2 P1.153(153_GP108) R?#64.1 U?#1.1(*OE1) U?#1.19(*OE2)
DSP_PWM1_~{FAULT}: P1.111(111_D1) U?#5.7(3Y)
DSP_PWM1_~{FAULT_5V}: C?#32.1 P?#13.6 R?#58.2 U?#5.6(3A)
DSP_PWM2~{_ENABL}E: C?#10.2 P1.155(155_GP93) R?#66.1 U?#2.1(*OE1) U?#2.19(*OE2)
DSP_PWM2_~{FAULT}: P1.109(109_D2) U?#5.9(4Y)
DSP_PWM2_~{FAULT_5V}: C?#31.1 P?#13.8 R?#57.2 U?#5.10(4A)
DSP_PWM3~{_ENABL}E: C?#16.2 P1.154(GP28_154) R?#65.2 U?#3.1(*OE1) U?#3.19(*OE2)
DSP_PWM3_~{FAULT}: P1.107(107_D3) U?#5.11(5Y)
DSP_PWM3_~{FAULT_5V}: C?#30.1 P?#13.10 R?#56.2 U?#5.12(5A)
DSP_PWM4~{_ENABL}E: C?#21.2 P1.156(GP29_156) R?#67.2 U?#4.1(*OE1) U?#4.19(*OE2)
DSP_PWM4_~{FAULT}: P1.105(105_D4) U?#5.13(6Y)
DSP_PWM4_~{FAULT_5V}: C?#29.1 P?#13.12 R?#55.2 U?#5.14(6A)
GND_2M1: P?#1.1 P?#1.2 P?#1.3 P?#1.4 P?#4.1 P?#4.2 P?#4.3 P?#4.4 R?#3.2 R?#14.2
GND_2M3: P?#7.1 P?#7.2 P?#7.3 P?#7.4 R?#25.2
GND_2M4: P?#10.1 P?#10.2 P?#10.3 P?#10.4 R?#30.2
IPM_IU1: D8.3 J?#1.5 P1.187(187_ADA1)
IPM_IU2: D12.3 J?#2.5 P1.181(181_ADB1)
IPM_IU3: D16.3 J?#3.5 P1.171(171_ADD1)
IPM_IU4: D20.3 J?#4.5
IPM_IV1: D9.3 J?#1.3 P1.186(ADA2_186)
IPM_IV2: D13.3 J?#2.3 P1.180(ADB2_180)
IPM_IV3: D17.3 J?#3.3 P1.170(ADD3_170)
IPM_IV4: D21.3 J?#4.3
IPM_IW1: D10.3 J?#1.1 P1.185(185_ADA3)
IPM_IW2: D14.3 J?#2.1 P1.179(179_ADB3)
IPM_IW3: D18.3 J?#3.1 P1.169(169_ADD2)
IPM_IW4: D22.3 J?#4.1
IPM_Temperature1: C?#24.2 D11.3 J?#1.9 P1.183(183_ADA5) R?#48.1 TP?#29.1
IPM_Temperature2: C?#34.2 D15.3 J?#2.9 P1.177(177_ADB5) R?#61.1 TP?#30.1
IPM_Temperature3: C?#37.2 D19.3 J?#3.9 P1.167(167_ADD4) R?#70.1 TP?#31.1
IPM_Temperature4: C?#40.2 D23.3 J?#4.9 P1.165(165_AD14) R?#75.1 TP?#32.1
IPM_TerminalDutyU1: DUTY?.9 J15.5 J?#1.23 R39.2
IPM_TerminalDutyU2: J16.5 J?#2.23 R43.2
IPM_TerminalDutyU3: J?#3.23
IPM_TerminalDutyU4: J?#4.23
IPM_TerminalDutyV1: DUTY?.5 J15.3 J?#1.21 R37.2
IPM_TerminalDutyV2: J16.3 J?#2.21 R42.2
IPM_TerminalDutyV3: J?#3.21
IPM_TerminalDutyV4: J?#4.21
IPM_TerminalDutyW1: DUTY?.1 J15.1 J?#1.19 R36.2
IPM_TerminalDutyW2: J16.1 J?#2.19 R40.2
IPM_TerminalDutyW3: J?#3.19
IPM_TerminalDutyW4: J?#4.19
IPM_VDC_BUS1: J?#1.7 P1.188(ADA0_188)
IPM_VDC_BUS2: C?#4.2 C?#9.2 D?#1.3 D?#2.3 J?#2.7 P1.182(ADB0_182) R?#2.2 R?#13.2 TP?#4.1 TP?#8.1
IPM_VDC_BUS3: C?#13.2 D?#3.3 J?#3.7 P1.172(ADD0_172) R?#24.2 TP?#15.1
IPM_VDC_BUS4: C?#18.2 D?#4.3 J?#4.7 R?#29.2 TP?#22.1
LED1: P1.11(11_GP3) R32.2
LED2: P1.12(GP2_12) R33.2
LED3: P1.13(13_GP9) R51.2
LED4: P1.14(GP8_14) R52.2
MQEP1A: J1.2 P1.21(21_GP96)
MQEP1B: J1.4 P1.22(GP97_22)
MQEP1S: J1.8 P1.23(23_GP98)
MQEP1Z: J1.6 P1.24(GP99_24)
MQEP2A: J10.2 P1.25(25_GP24)
MQEP2B: J10.4 P1.26(GP25_26)
MQEP2S: J10.8 P1.27(27_GP26)
MQEP2Z: J10.6 P1.28(GP27_28)
MQEP3A: J11.2 P1.29(29_GP104)
MQEP3B: J11.4 P1.30(GP105_30)
MQEP3S: J11.8 P1.31(31_GP106)
MQEP3Z: J11.6 P1.32(GP107_32)
MUSB_BZ: J17.20 P1.52(GP111_52)
MUSB_DM: J17.14 P1.46(GP42_46)
MUSB_DP: J17.19 P1.51(51_GP121)
MUSB_EN: J17.13 P1.45(45_GP43)
MUSB_FLT: J17.15 P1.47(47_GP120)
MUSB_ID: J17.16 P1.48(GP112_48)
MUSB_INT: J17.17 P1.49(49_GP53)
MUSB_VB: J17.18 P1.50(GP114_50)
PWM1A_5V: P?#2.2 TP?#1.1 U?#1.17(Y2)
PWM1B_5V: P?#2.8 TP?#5.1 U?#1.14(Y5)
PWM2A_5V: P?#2.4 TP?#2.1 U?#1.16(Y3)
PWM2B_5V: P?#2.10 TP?#6.1 U?#1.13(Y6)
PWM3A_5V: P?#2.6 TP?#3.1 U?#1.15(Y4)
PWM3B_5V: P?#2.12 TP?#7.1 U?#1.12(Y7)
PWM4A_5V: P?#6.2 TP?#9.1 U?#2.17(Y2)
PWM4B_5V: P?#6.8 TP?#12.1 U?#2.14(Y5)
PWM5A_5V: P?#6.4 TP?#10.1 U?#2.16(Y3)
PWM5B_5V: P?#6.10 TP?#13.1 U?#2.13(Y6)
PWM6A_5V: P?#6.6 TP?#11.1 U?#2.15(Y4)
PWM6B_5V: P?#6.12 TP?#14.1 U?#2.12(Y7)
PWM7A_5V: P?#9.2 TP?#16.1 U?#3.17(Y2)
PWM7B_5V: P?#9.8 TP?#19.1 U?#3.14(Y5)
PWM8A_5V: P?#9.4 TP?#17.1 U?#3.16(Y3)
PWM8B_5V: P?#9.10 TP?#20.1 U?#3.13(Y6)
PWM9A_5V: P?#9.6 TP?#18.1 U?#3.15(Y4)
PWM9B_5V: P?#9.12 TP?#21.1 U?#3.12(Y7)
PWM10A_5V: P?#12.2 TP?#23.1 U?#4.17(Y2)
PWM10B_5V: P?#12.8 TP?#26.1 U?#4.14(Y5)
PWM11A_5V: P?#12.4 TP?#24.1 U?#4.16(Y3)
PWM11B_5V: P?#12.10 TP?#27.1 U?#4.13(Y6)
PWM12A_5V: P?#12.6 TP?#25.1 U?#4.15(Y4)
PWM12B_5V: P?#12.12 TP?#28.1 U?#4.12(Y7)
QEP1_HALL_U: J1.1 P1.62(GP68_62)
QEP1_HALL_V: J1.3 P1.60(GP94_60)
QEP1_HALL_W: J1.5 P1.58(GP17_58)
QEP2_HALL_U: J10.1 P1.68(GP115_68)
QEP2_HALL_V: J10.3 P1.66(GP32_66)
QEP2_HALL_W: J10.5 P1.64(GP67_64)
QEP3_HALL_U: J11.1 P1.70(GP117_70)
QEP3_HALL_V: J11.3 P1.72(GP130_72)
QEP3_HALL_W: J11.5 P1.74(GP54_74)
~{SPI_A_STE_HS}: J12.10 P1.43(43_GP61)
SPI B MI HS: P1.147(147_GP64)
SPI B MO HS: P1.145(145_GP63)
SPI_A_CK_HS: J12.11 P1.44(GP60_44)
SPI_A_MI_HS: J12.12 P1.77(77_GP59)
SPI_A_MO_HS: J12.9 P1.75(75_GP58)
SPI_B_CK_HS: P1.146(GP65_146)
SPI_C_CK_HS: J12.3 P1.87(87_D13)
SPI_C_MI_HS: J12.4 P1.85(85_D14)
SPI_C_MO_HS: J12.1 P1.83(83_D15)
TEMP1: R?#46.1 TMP?.1
TEMP2: R?#59.1 TMP?.3
TEMP3: R?#68.1 TMP?.7
TEMP4: R?#73.1 TMP?.9
UART_SCI_RXDA: J9.17 P1.129(129_GP136)
UART_SCI_RXDB: J9.15 P1.127(127_GP138)
UART_SCI_RXDC: J9.18 P1.135(135_GP139)
UART_SCI_RXDD: J9.4 P1.15(15_GP141)
UART_SCI_TXDA: J9.19 P1.131(131_GP135)
UART_SCI_TXDB: J9.13 P1.117(117_GP137)
UART_SCI_TXDC: J9.20 P1.136(GP140_136)
UART_SCI_TXDD: J9.2 P1.16(GP142_16)
VCO_ECAP1: J15.2 P1.84(A19_84) R36.1
VCO_ECAP2: J15.4 P1.86(A18_86) R37.1
VCO_ECAP3: J15.6 P1.88(A17_88) R39.1
VCO_ECAP4: J16.2 P1.90(A16_90) R40.1
VCO_ECAP5: J16.4 P1.92(A15_92) R42.1
VCO_ECAP6: J16.6 P1.94(A14_94) R43.1
VSO1: D24.3 J13.2 LEM?.1 LEM?.2
VSO2: D25.3 J13.4 LEM?.3 LEM?.4
VSO3: D26.3 J13.6 LEM?.5 LEM?.6
VSO4: D27.3 J14.2
VSO5: D28.3 J14.4
VSO6: D29.3 J14.6
NetC?#1_1: C?#1.1 N?#1.2 R?#1.1 R?#3.1
NetC?#1_2: C?#1.2 N?#1.1 R?#1.2 R?#2.1
NetC?#5_2: C?#5.2 N?#1.3 R?#4.1 R?#5.2
NetC?#7_1: C?#7.1 N?#2.6 R?#12.1 R?#14.1
NetC?#7_2: C?#7.2 N?#2.7 R?#12.2 R?#13.1
NetC?#11_2: C?#11.2 N?#2.5 R?#15.1 R?#16.2
NetC?#12_1: C?#12.1 N1.9 R?#17.1 R?#25.1
NetC?#12_2: C?#12.2 N1.8 R?#17.2 R?#24.1
NetC?#14_2: C?#14.2 N1.10 R?#26.1 R?#27.2
NetC?#17_1: C?#17.1 N?#3.13 R?#28.1 R?#30.1
NetC?#17_2: C?#17.2 N?#3.14 R?#28.2 R?#29.1
NetC?#19_2: C?#19.2 N?#3.12 R?#37.1 R?#38.2
NetC?#22_1: C?#22.1 N?#4.2 R?#45.2 R?#47.1
NetC?#22_2: C?#22.2 N?#4.1 R?#45.1 R?#48.2
NetC?#27_2: C?#27.2 D?#5.3 N?#4.3 R?#46.2 R?#49.1
NetC?#33_1: C?#33.1 N?#5.6 R?#54.2 R?#60.1
NetC?#33_2: C?#33.2 N?#5.7 R?#54.1 R?#61.2
NetC?#35_2: C?#35.2 D?#6.3 N?#5.5 R?#59.2 R?#62.1
NetC?#36_1: C?#36.1 N?#6.9 R?#63.2 R?#69.1
NetC?#36_2: C?#36.2 N?#6.8 R?#63.1 R?#70.2
NetC?#38_2: C?#38.2 D?#7.3 N?#6.10 R?#68.2 R?#71.1
NetC?#39_1: C?#39.1 N?#7.13 R?#72.2 R?#74.1
NetC?#39_2: C?#39.2 N?#7.14 R?#72.1 R?#75.2
NetC?#41_2: C?#41.2 D?#8.3 N?#7.12 R?#73.2 R?#76.1
NetD1_2: D1.2(K) R30.2
NetD2_2: D2.2(K) R31.2
NetD30_2: D30.2(K) R49.2
NetD31_2: D31.2(K) R50.2
NetLEM?_7: LEM?.7 RU?.2
NetP?#13_2: P?#13.2 R?#52.2
NetP?#13_4: P?#13.4 R?#53.2
NetQ1_1: Q1.1(B) R51.1 R53.1
NetQ1_3: Q1.3(C) R49.1
NetQ2_1: Q2.1(B) R32.1 R34.1
NetQ2_3: Q2.3(C) R30.1
NetQ3_1: Q3.1(B) R33.1 R35.1
NetQ3_3: Q3.3(C) R31.1
NetQ4_1: Q4.1(B) R52.1 R54.1
NetQ4_3: Q4.3(C) R50.1

Not connected (* = marked no-connect by the designer): D25 1 2; D26 1 2; D28 1 2; D29 1 2; DUTY? 3* 7*; J1 15* 18* 20*; J10 15* 18* 20*; J11 15* 18* 20*; J13 5*; J14 5*; J17 2 4 9 11; J?#1 22 24 25 26 27 28 29 30; J?#2 22 24; J?#3 22 24; J?#4 22 24; P1 19(19_GP16) 20(GP10_20) 35(35_GP22) 36(GP23_36) 37(37_GP5) 38(GP7_38) 39(39_GP12) 40(GP13_40) 41(41_GP14) 42(GP15_42) 53(53_GP100) 54(GP103_54) 55(55_GP102) 56(GP101_56) 57(57_GP30) 59(59_GP57) 61(61_GP66) 63(63_GP131) 65(65_GP116) 67(67_GP127) 69(69_GP128) 71(71_GP126) 73(73_GP95) 76(GP56_76) 78(GP55_78) 79(79_GP4) 80(GP6_80) 91(91_D11) 93(93_D10) 96(A13_96) 98(A12_98) 99(99_D7) 100(A11_100) 101(101_D6) 102(A10_102) 103(103_D5) 104(A9_104) 106(A8_106) 108(A7_108) 110(A6_110) 112(A5_112) 113(113_D0) 114(A4_114) 115(115_GP36) 116(A3_116) 118(A2_118) 120(A1_120) 121(121_GP125) 122(A0_122) 123(123_WE) 124(CS2_124) 125(125_RD) 126(RESET_126) 128(GP113_128) 130(GP110_130) 132(GP123_132) 133(133_GP134) 134(GP114_134) 137(137_GP18) 138(GP11_138) 139(139_GP133) 140(GP119_140) 141(141_GP132) 142(GP129_142) 143(143_GP118) 144(CS3_144) 148(GP143_148) 149(149_GP1) 150(GP0_150) 151 152(GP122_152) 166(AD15_166) 168(ADD5_168) 173(173_ADC5) 174(ADC4_174) 175(175_ADC3) 176(ADC2_176) 178(ADB4_178) 184(ADA4_184); POWER? 29 30; RU? 1; U3 1(TP)* 3(NIC) 5(TRIM)* 7(NIC) 8(TP); U?#1 2(A1)* 9(A8)* 11(Y8)* 18(Y1)*; U?#2 2(A1)* 9(A8)* 11(Y8)* 18(Y1)*; U?#3 2(A1)* 9(A8)* 11(Y8)* 18(Y1)*; U?#4 2(A1)* 9(A8)* 11(Y8)* 18(Y1)*

### Layout directives
net class SectionConnector: -5V_ADC, A+5V, AGND, D+5V, DI_1, DI_2, DSP_A_CAN_RX, DSP_A_CAN_TX, DSP_B_CAN_RX, DSP_B_CAN_TX, DSP_PWM1_~{FAULT_5V}, DSP_PWM2_~{FAULT_5V}, DSP_PWM3_~{FAULT_5V}, DSP_PWM4_~{FAULT_5V}, IPM_TerminalDutyU1, IPM_TerminalDutyU2, IPM_TerminalDutyV1, IPM_TerminalDutyV2, IPM_TerminalDutyW1, IPM_TerminalDutyW2, MQEP1A, MQEP1B, MQEP1S, MQEP1Z, MQEP2A, MQEP2B, MQEP2S, MQEP2Z, MQEP3A, MQEP3B, MQEP3S, MQEP3Z, PE_GND, QEP1_HALL_U, QEP1_HALL_V, QEP1_HALL_W, QEP2_HALL_U, QEP2_HALL_V, QEP2_HALL_W, QEP3_HALL_U, QEP3_HALL_V, QEP3_HALL_W, REF_3V, SPI_A_CK_HS, SPI_A_MI_HS, SPI_A_MO_HS, SPI_C_CK_HS, SPI_C_MI_HS, SPI_C_MO_HS, UART_SCI_RXDA, UART_SCI_RXDB, UART_SCI_RXDC, UART_SCI_RXDD, UART_SCI_TXDA, UART_SCI_TXDB, UART_SCI_TXDC, UART_SCI_TXDD, VCO_ECAP1, VCO_ECAP2, VCO_ECAP3, VCO_ECAP4, VCO_ECAP5, VCO_ECAP6, VDD, ~{SPI_A_STE_HS}, ~{SPI_C_STE_H}S

### Notes on the sheet
- 电平转换 From DSP 3.3V to 5V
- (near R?#1) 四个逆变器的电池电压检测电路（单电源供电轨到轨运放）
- (near D?#1) 3V对应母线电压600V
- (near C?#4) VDC    300V-1.5V
- (near D?#2) 3V对应母线电压600V
- (near C?#9) VDC    300V-1.5V
- (near D?#3) 3V对应母线电压600V
- (near C?#13) VDC    300V-1.5V
- (near D?#4) 3V对应母线电压600V
- (near C?#18) VDC    300V-1.5V
- What is strobe encoder? A signal used to time reading that is output together with the data. Data is read on the falling edge of the strobe signal. A strobe signal is required to connect to devices for high-speed input or high-speed response, such as microcomputer boards
- (near J1) 3*牛角：编码器电源出/信号进
- 四个逆变器的电池电压检测电路（单电源供电轨到轨运放）
- mini-USB
- 串行通讯
- (near J12) DAC
- 四个三相逆变器的温度检测电路，轨到轨运放
- (near P1) The GPIO input qualification can be set to synchronous or asynchronous mode. Using synchronized inputs can help with noise immunity; however, when synchronized inputs are used this will affect the eCAP's accuracy ±2 cycles.
- 差分温度检测电路
- TODO: 电容离芯片近，过了电容再进芯片
- 5V-3V电平转换
- 数字输入
- (near D?#5) 过压保护
- (near LEM?) 电流传感器
- DSP从Flash启动需要拉到3.3V高电平
- (near D?#6) 过压保护
- (near R?#64) ENPWM上拉到VDD，默认封波，安全
- (near R?#65) ENPWM上拉到VDD，默认封波，安全
- AD14/15
- (near P1) ADC can do multiplexing, meaning that you should use only one channel ADC to measure all temperatatures (slow varying)
- ADD
- (near D?#7) 过压保护
- ADB
- ADC
- ADA
- (near D?#8) 过压保护
- ECAP（抓上升下降沿时差）
- (near J15) ECAP（需要手动短接针头）
- (near POWER?) POWER 电源进！
- (near D1) 信号灯
- 三相PWM输出；电流、温度传感器是模拟量，QEP端电压占空比是数字量
- LEM电流传感器反馈（可选）
- (near D24) 3V对应母线电压600V
- (near DUTY?) 天外飞板
- (near R45) 功率地和信号地的NetTie
- (near D27) 3V对应母线电压600V
- 测试点
- Labels drawn without touching a wire or pin: IPM_IU1, IPM_IU4, IPM_IV1, IPM_IV4, IPM_IW1, IPM_IW4, IPM_VDC_BUS4
- (in symbol TMS320F28377D-BGA-Core) P1A; TMS320F28377D; P1B; P1C

### Library data of the parts
C17 C18 = Cap Pol3: Polarized Capacitor (Surface Mount); Value: 100pF; Published: 8-Jun-2000; LatestRevisionDate: 29-May-2009; LatestRevisionNote: IPC-7351 Footprint Added.; PackageReference: C0805; Publisher: Altium Limited; PackageDescription: Chip Capacitor; ClassName: Power
C19 C20 C?#27 C?#35 C?#38 C?#41 = Cap Semi: Capacitor (Semiconductor SIM Model); Published: 8-Jun-2000; LatestRevisionDate: 17-Jul-2002; LatestRevisionNote: Re-released for DXP Platform.; PackageReference: C1206; Publisher: Altium Limited
  C19 C20: ClassName: Power
C?#1-C?#26 C?#28-C?#34 C?#36 C?#37 C?#39 C?#40 = Cap: Capacitor; Published: 8-Jun-2000; LatestRevisionDate: 17-Jul-2002; LatestRevisionNote: Re-released for DXP Platform.; PackageReference: RAD-0.3; Publisher: Altium Limited
  C?#6 C?#28: Value: 104
  C?#22 C?#33 C?#36 C?#39: Value: 103
  C?#23 C?#25 C?#26 C?#29-C?#32: ClassName: Encoder
  C?#24 C?#34 C?#37 C?#40: Value: 102
D1 D2 D30 D31 = LED0: Typical INFRARED GaAs LED; Published: 8-Jun-2000; LatestRevisionDate: 08-Jul-2005; LatestRevisionNote: Mech Layer 1 removed.; PackageReference: LED-0; Publisher: Altium Limited; PackageDescription: LED; 2 Leads; ClassName: HelloDSP
D8-D29 D?#1-D?#4 = MMBD1203二三极管
D?#5-D?#8 = D Zener: Zener Diode; Published: 8-Jun-2000; LatestRevisionDate: 17-Jul-2002; LatestRevisionNote: Re-released for DXP Platform.; PackageReference: DIODE-0.7; Publisher: Altium Limited; PackageDescription: Diode, Thru-Hole; 2 Leads; 0.7 in Pin Spacing
DUTY? J15 J16 TMP? = HIF3FC-10PA-2.54DSA: Connector; Manufacturer_Name: Hirose; Manufacturer_Part_Number: HIF3FC-10PA-2.54DSA(71); Datasheet Link: https://componentsearchengine.com/Datasheets/1/HIF3FC-10PA-2.54DSA(71).pdf; Height: 9.2mm; Mouser Part Number: 798-HIF3FC10PA254D71; Mouser Price/Stock: https://www.mouser.co.uk/ProductDetail/Hirose-Connector/HIF3FC-10PA-2.54DSA71?qs=eDUdFcBPps26f2LJxn%252B8VA%3D%3D
  DUTY? J15 TMP?: System: Connector
J1 J9-J12 J17 = HIF3FC-20PA-2.54DSA: Connector; Manufacturer_Name: Hirose; Manufacturer_Part_Number: HIF3FC-20PA-2.54DSA(71); Datasheet Link: https://www.hirose.com/product/en/products/HIF3FC/HIF3FC-20PA-2.54DSA%2871%29/; Height: 9.5mm; Mouser Part Number: 798-HIF3FC20PA254D71; Mouser Price/Stock: https://www.mouser.co.uk/ProductDetail/Hirose-Connector/HIF3FC-20PA-254DSA71?qs=eDUdFcBPps3XO21sCrEU%252BQ%3D%3D; Arrow Part Number: HIF3FC-20PA-2.54DSA(71); Arrow Price/Stock: https://www.arrow.com/en/products/hif3fc-20pa-2.54dsa-71/hirose-electric?region=nac
  J1 J9 J12 J17: System: Connector
J13 J14 = HIF3FC-10PA-2.54DSA_71_: Connector; Manufacturer_Name: Hirose; Manufacturer_Part_Number: HIF3FC-10PA-2.54DSA(71); Datasheet Link: https://componentsearchengine.com/Datasheets/1/HIF3FC-10PA-2.54DSA(71).pdf; Height: 9.2mm; Mouser Part Number: 798-HIF3FC10PA254D71; Mouser Price/Stock: https://www.mouser.co.uk/ProductDetail/Hirose-Connector/HIF3FC-10PA-2.54DSA71?qs=eDUdFcBPps26f2LJxn%252B8VA%3D%3D; System: Connector
J?#1-J?#4 LEM? POWER? = HIF3FC-30PA-2.54DSA: Connector; Manufacturer_Name: Hirose; Manufacturer_Part_Number: HIF3FC-30PA-2.54DSA(71); Datasheet Link: https://datasheet.datasheetarchive.com/originals/distributors/SFDatasheet-7/sf-000141320.pdf; Height: 12mm; Mouser Part Number: 798-HIF3FC30PA254D71; Mouser Price/Stock: https://www.mouser.co.uk/ProductDetail/Hirose-Connector/HIF3FC-30PA-254DSA71?qs=eDUdFcBPps32%2FyAdBVx6ww%3D%3D
  J?#1 J?#4 POWER?: System: Connector
P?#1 P?#3-P?#5 P?#7 P?#8 P?#10 P?#11 = Header 2X2: Header, 2-Pin, Dual row; LatestRevisionDate: 17-Jul-2002; LatestRevisionNote: Re-released for DXP Platform.; Publisher: Altium Limited
P?#2 P?#6 P?#9 P?#12 P?#13 = Header 6X2: Header, 6-Pin, Dual row; LatestRevisionDate: 17-Jul-2002; LatestRevisionNote: Re-released for DXP Platform.; Publisher: Altium Limited
Q1-Q4 = NPN: NPN Bipolar Transistor; Published: 8-Jun-2000; LatestRevisionDate: 17-Jul-2002; LatestRevisionNote: Re-released for DXP Platform.; PackageReference: TO-226-AA; Publisher: Altium Limited; PackageDescription: TO, Flat Index; 3 In-Line, Axial Leads; Body Dia. 4.8mm; Leads 0.55 x 0.51 mm (max); Code_JEDEC: TO-226-AA; ClassName: HelloDSP
R6 R13 R30 R31 R49 R50 = Res2: Resistor; Value: 300R; Published: 8-Jun-2000; LatestRevisionDate: 17-Jul-2002; LatestRevisionNote: Re-released for DXP Platform.; PackageReference: AXIAL-0.4; Publisher: Altium Limited; ClassName: HelloDSP
R32-R37 R39 R40 R42 R43 R45 R46 R51-R56 R?#1-R?#76 = Res2: Resistor; Published: 8-Jun-2000; LatestRevisionDate: 17-Jul-2002; LatestRevisionNote: Re-released for DXP Platform.; PackageReference: AXIAL-0.4; Publisher: Altium Limited
  R32 R33 R51 R52: Value: 10K; ClassName: HelloDSP
  R34 R35 R53 R54: Value: 2K; ClassName: HelloDSP
  R36 R37 R39 R40 R42 R43 R?#3 R?#4 R?#14 R?#15 R?#25 R?#26 R?#30 R?#37 R?#50-R?#53 R?#55-R?#58: ClassName: Encoder
  R?#1 R?#5 R?#12 R?#16 R?#17 R?#27 R?#28 R?#38 R?#46 R?#47 R?#49 R?#59 R?#60 R?#62 R?#68 R?#69 R?#71 R?#73 R?#74 R?#76: Value: 10K
  R?#2 R?#13 R?#24 R?#29: Value: 1K
  R?#45 R?#54 R?#63 R?#72: Value: 10k
  R?#48 R?#61 R?#70 R?#75: Value: 470R
RU? = Res2: Resistor; Value: 10K; Published: 8-Jun-2000; LatestRevisionDate: 17-Jul-2002; LatestRevisionNote: Re-released for DXP Platform.; PackageReference: AXIAL-0.4; Publisher: Altium Limited
TP7 TP?#1-TP?#32 U6 U7 = TP-黄色测试点: Add into BOM: yes; Name: TP-黄色测试点; Symbol: TP-黄色测试点; Device: TP-黄色测试点; LCSC Part Name: TP-黄色测试点; Supplier Part: C9900007422; Manufacturer Part: TP-黄色测试点; Supplier Footprint: TESTPOINT-TH_BD-2P-P2.00; JLCPCB Part Class: Extended Part; Datasheet: https://atta.szlcsc.comnull; Supplier: LCSC; Convert to PCB: yes
TP8 = 测试点: ClassName: HelloDSP
U3 = ADR423ARZ: Imported; Manufacturer_Part_Number: ADR423ARZ; Vendor: Vendor; Value: Value; Type: Type; RefDes: Refdes; ClassName: Power
U?#1-U?#4 = SN74ABT541: SOIC-20-DW
U?#5 = SN74HC365D: ClassName: Encoder